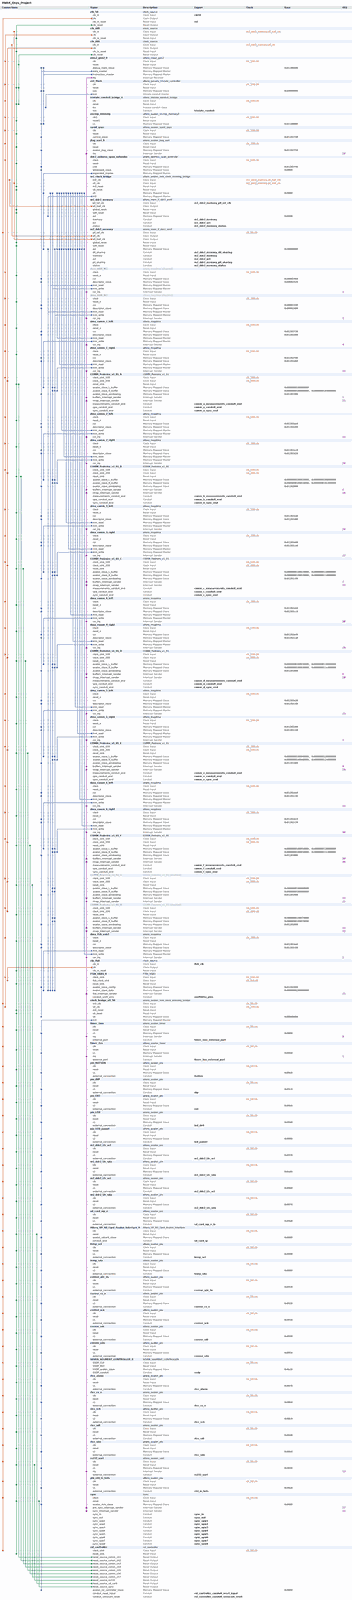
[diagram p0: system contents, whole]
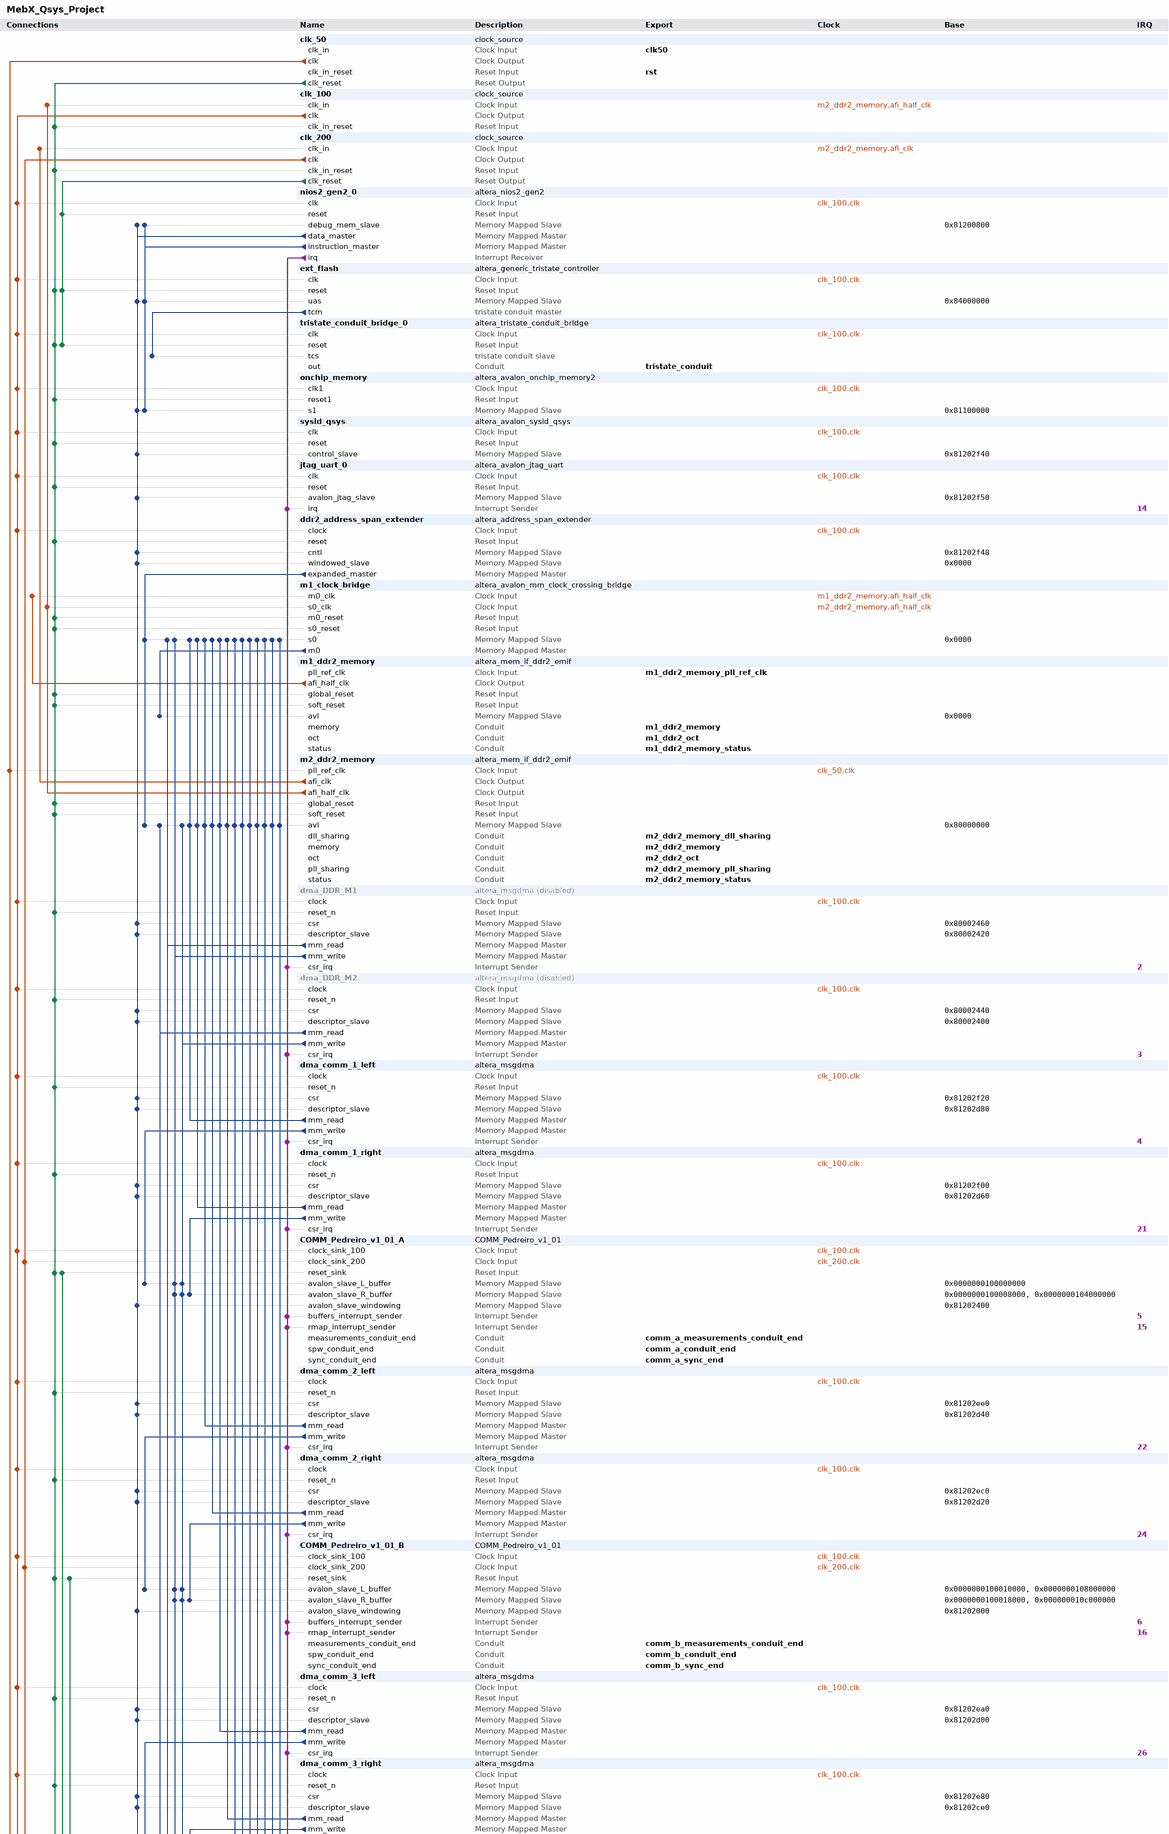
[diagram p1: system contents, upper part]
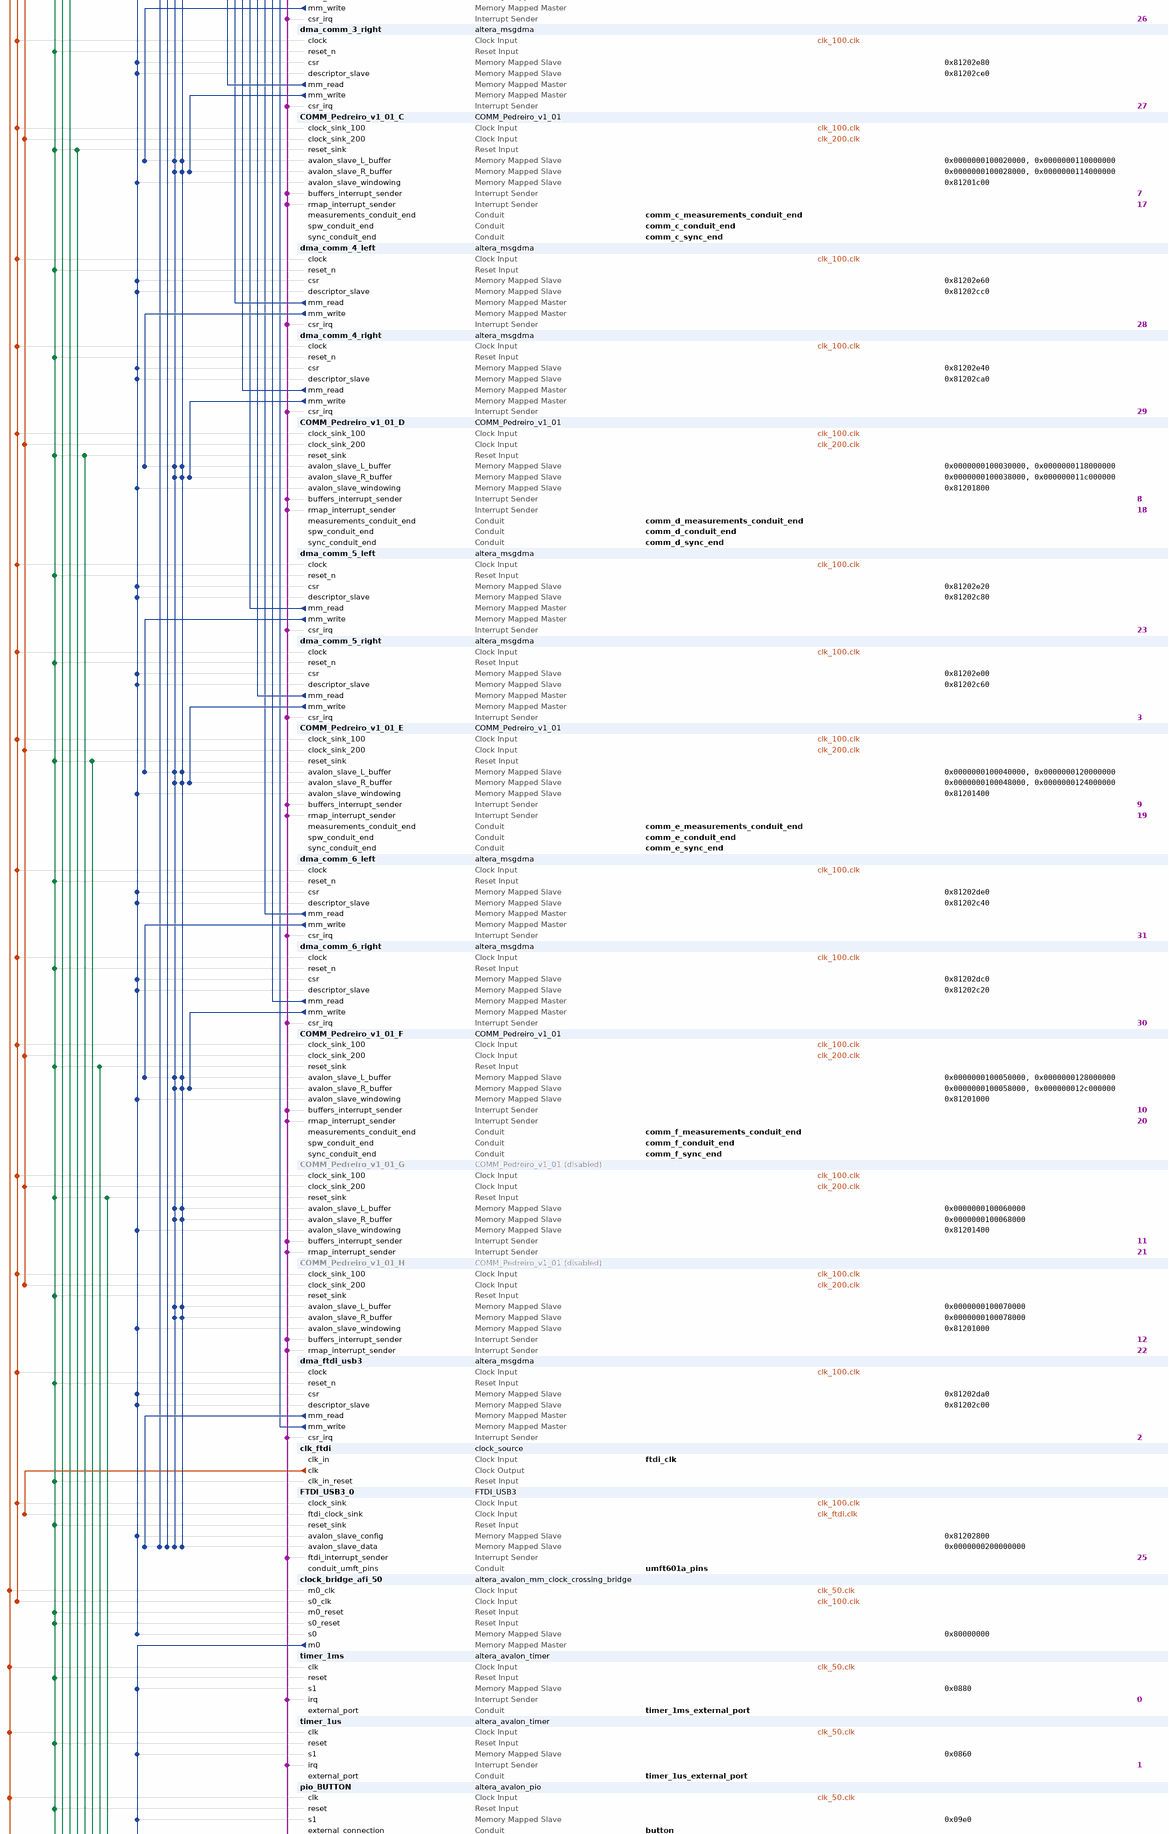
[diagram p2: system contents, middle part]
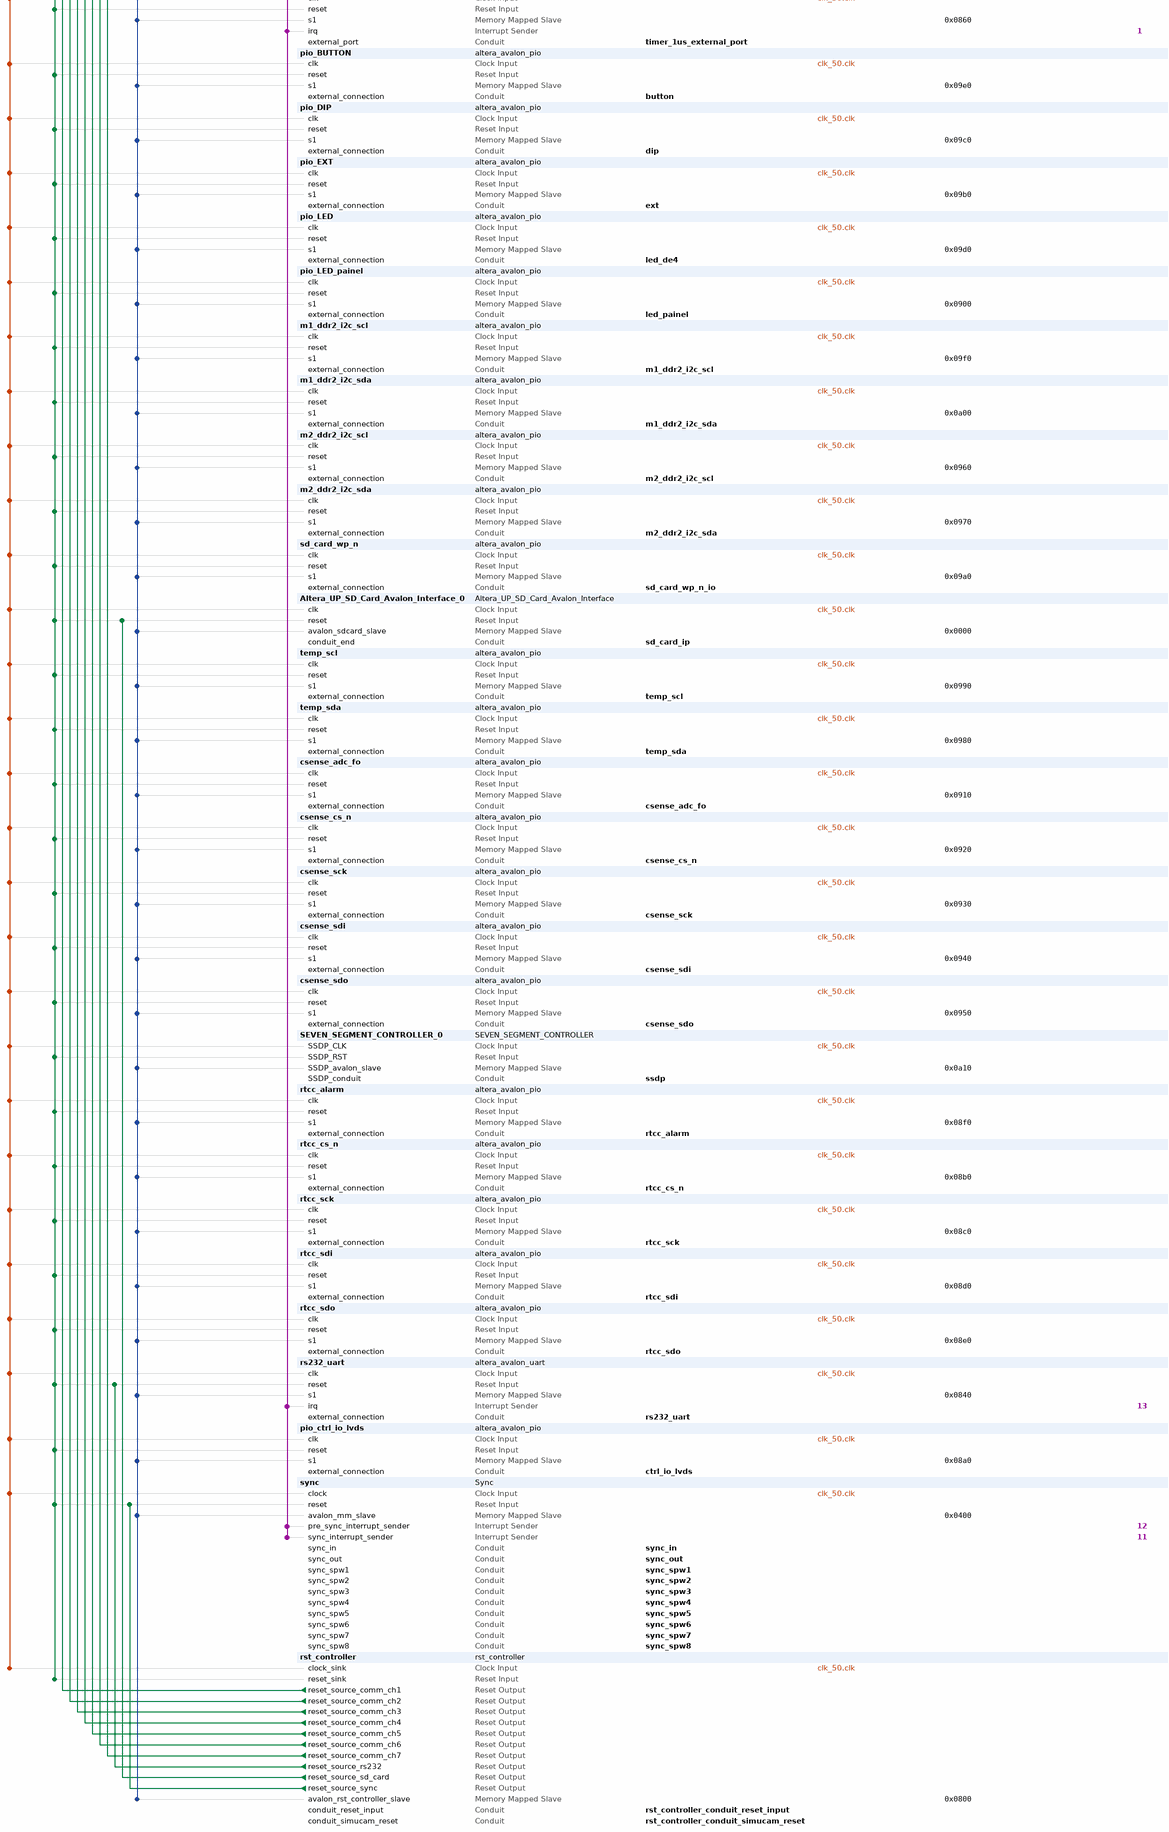
[diagram p3: system contents, lower part]
# Platform Designer (Qsys) system MebX_Qsys_Project, Stratix IV EP4SGX530KH40C2
# Parameters at their usual value, and those the tool derives, are not listed.
package require -exact qsys 18.1
create_system MebX_Qsys_Project
set_project_property DEVICE_FAMILY {Stratix IV}
set_project_property DEVICE EP4SGX530KH40C2

add_instance clk_50 clock_source 18.1
set_instance_parameter_value clk_50 clockFrequency 50000000

add_instance clk_100 clock_source 18.1
set_instance_parameter_value clk_100 clockFrequency 100000000

add_instance clk_200 clock_source 18.1
set_instance_parameter_value clk_200 clockFrequency 200000000

add_instance nios2_gen2_0 altera_nios2_gen2 18.1
set_instance_parameter_value nios2_gen2_0 dcache_size 0
set_instance_parameter_value nios2_gen2_0 debug_hwbreakpoint 2
set_instance_parameter_value nios2_gen2_0 dividerType srt2
set_instance_parameter_value nios2_gen2_0 exceptionSlave onchip_memory.s1
set_instance_parameter_value nios2_gen2_0 icache_burstType Sequential
set_instance_parameter_value nios2_gen2_0 icache_size 4096
set_instance_parameter_value nios2_gen2_0 impl Fast
set_instance_parameter_value nios2_gen2_0 mul_64_impl 1
set_instance_parameter_value nios2_gen2_0 mul_shift_choice 1
set_instance_parameter_value nios2_gen2_0 resetOffset 33685504
set_instance_parameter_value nios2_gen2_0 resetSlave ext_flash.uas
set_instance_parameter_value nios2_gen2_0 setting_support31bitdcachebypass false

add_instance ext_flash altera_generic_tristate_controller 18.1
set_instance_parameter_value ext_flash ACTIVE_LOW_BEGINTRANSFER 0
set_instance_parameter_value ext_flash ACTIVE_LOW_BYTEENABLE 0
set_instance_parameter_value ext_flash ACTIVE_LOW_OUTPUTENABLE 0
set_instance_parameter_value ext_flash ACTIVE_LOW_READ 1
set_instance_parameter_value ext_flash CHIPSELECT_THROUGH_READLATENCY 0
set_instance_parameter_value ext_flash INTERFACE_ASSIGNMENT_KEYS embeddedsw.configuration.isFlash,embeddedsw.configuration.isNonVolatileStorage,embeddedsw.configuration.isMemoryDevice
set_instance_parameter_value ext_flash INTERFACE_ASSIGNMENT_VALUES 1,1,1
set_instance_parameter_value ext_flash MODULE_ASSIGNMENT_KEYS embeddedsw.configuration.hwClassnameDriverSupportList,embeddedsw.configuration.hwClassnameDriverSupportDefault,embeddedsw.CMacro.SETUP_VALUE,embeddedsw.CMacro.WAIT_VALUE,embeddedsw.CMacro.HOLD_VALUE,embeddedsw.CMacro.TIMING_UNITS,embeddedsw.CMacro.SIZE,embeddedsw.memoryInfo.MEM_INIT_DATA_WIDTH,embeddedsw.memoryInfo.HAS_BYTE_LANE,embeddedsw.memoryInfo.IS_FLASH,embeddedsw.memoryInfo.GENERATE_DAT_SYM,embeddedsw.memoryInfo.GENERATE_FLASH,embeddedsw.memoryInfo.DAT_SYM_INSTALL_DIR,embeddedsw.memoryInfo.FLASH_INSTALL_DIR
set_instance_parameter_value ext_flash MODULE_ASSIGNMENT_VALUES "altera_avalon_lan91c111\\,altera_avalon_cfi_flash,altera_avalon_cfi_flash,25,100,20,\"ns\",33554432u,16,1,1,1,1,SIM_DIR,APP_DIR"
set_instance_parameter_value ext_flash TCM_ADDRESS_W 26
set_instance_parameter_value ext_flash TCM_BYTEENABLE_W 2
set_instance_parameter_value ext_flash TCM_DATA_HOLD 20
set_instance_parameter_value ext_flash TCM_DATA_W 16
set_instance_parameter_value ext_flash TCM_MAX_PENDING_READ_TRANSACTIONS 3
set_instance_parameter_value ext_flash TCM_READLATENCY 2
set_instance_parameter_value ext_flash TCM_READ_WAIT 100
set_instance_parameter_value ext_flash TCM_SETUP_WAIT 25
set_instance_parameter_value ext_flash TCM_SYMBOLS_PER_WORD 2
set_instance_parameter_value ext_flash TCM_TIMING_UNITS 0
set_instance_parameter_value ext_flash TCM_TURNAROUND_TIME 2
set_instance_parameter_value ext_flash TCM_WRITE_WAIT 100
set_instance_parameter_value ext_flash USE_BEGINTRANSFER 0
set_instance_parameter_value ext_flash USE_BYTEENABLE 0
set_instance_parameter_value ext_flash USE_OUTPUTENABLE 0
set_instance_parameter_value ext_flash USE_READ 1

add_instance tristate_conduit_bridge_0 altera_tristate_conduit_bridge 18.1

add_instance onchip_memory altera_avalon_onchip_memory2 18.1
set_instance_parameter_value onchip_memory blockType M9K
set_instance_parameter_value onchip_memory dataWidth 32
set_instance_parameter_value onchip_memory dualPort false
set_instance_parameter_value onchip_memory initMemContent false
set_instance_parameter_value onchip_memory initializationFileName onchip_mem.hex
set_instance_parameter_value onchip_memory memorySize 1048576

add_instance sysid_qsys altera_avalon_sysid_qsys 18.1
set_instance_parameter_value sysid_qsys id 113

add_instance jtag_uart_0 altera_avalon_jtag_uart 18.1
set_instance_parameter_value jtag_uart_0 simInteractiveOptions NO_INTERACTIVE_WINDOWS

add_instance ddr2_address_span_extender altera_address_span_extender 18.1
set_instance_parameter_value ddr2_address_span_extender BURSTCOUNT_WIDTH 8
set_instance_parameter_value ddr2_address_span_extender DATA_WIDTH 32
set_instance_parameter_value ddr2_address_span_extender ENABLE_SLAVE_PORT true
set_instance_parameter_value ddr2_address_span_extender MASTER_ADDRESS_DEF 0
set_instance_parameter_value ddr2_address_span_extender MAX_PENDING_READS 8
set_instance_parameter_value ddr2_address_span_extender SLAVE_ADDRESS_WIDTH 29

add_instance m1_clock_bridge altera_avalon_mm_clock_crossing_bridge 18.1
set_instance_parameter_value m1_clock_bridge ADDRESS_WIDTH 31
set_instance_parameter_value m1_clock_bridge COMMAND_FIFO_DEPTH 8
set_instance_parameter_value m1_clock_bridge DATA_WIDTH 256
set_instance_parameter_value m1_clock_bridge MASTER_SYNC_DEPTH 2
set_instance_parameter_value m1_clock_bridge MAX_BURST_SIZE 4
set_instance_parameter_value m1_clock_bridge RESPONSE_FIFO_DEPTH 8
set_instance_parameter_value m1_clock_bridge SLAVE_SYNC_DEPTH 2
set_instance_parameter_value m1_clock_bridge USE_AUTO_ADDRESS_WIDTH 1

add_instance m1_ddr2_memory altera_mem_if_ddr2_emif 18.1
set_instance_parameter_value m1_ddr2_memory AVL_MAX_SIZE 128
set_instance_parameter_value m1_ddr2_memory CALIBRATION_MODE Full
set_instance_parameter_value m1_ddr2_memory DLL_SHARING_MODE None
set_instance_parameter_value m1_ddr2_memory EXPORT_AFI_HALF_CLK true
set_instance_parameter_value m1_ddr2_memory MEM_BANKADDR_WIDTH 3
set_instance_parameter_value m1_ddr2_memory MEM_CLK_FREQ 400.0
set_instance_parameter_value m1_ddr2_memory MEM_COL_ADDR_WIDTH 10
set_instance_parameter_value m1_ddr2_memory MEM_DQ_WIDTH 64
set_instance_parameter_value m1_ddr2_memory MEM_NUMBER_OF_RANKS_PER_DIMM 2
set_instance_parameter_value m1_ddr2_memory MEM_ROW_ADDR_WIDTH 14
set_instance_parameter_value m1_ddr2_memory MEM_TCL 5
set_instance_parameter_value m1_ddr2_memory MEM_TRAS_NS 45.0
set_instance_parameter_value m1_ddr2_memory PLL_SHARING_MODE None
set_instance_parameter_value m1_ddr2_memory POWER_OF_TWO_BUS true
set_instance_parameter_value m1_ddr2_memory REF_CLK_FREQ 50.0
set_instance_parameter_value m1_ddr2_memory TIMING_TDQSQ 240
set_instance_parameter_value m1_ddr2_memory TIMING_TIH 375
set_instance_parameter_value m1_ddr2_memory TIMING_TQHS 340
set_instance_parameter_value m1_ddr2_memory USER_DEBUG_LEVEL 0

add_instance m2_ddr2_memory altera_mem_if_ddr2_emif 18.1
set_instance_parameter_value m2_ddr2_memory AVL_MAX_SIZE 128
set_instance_parameter_value m2_ddr2_memory CALIBRATION_MODE Full
set_instance_parameter_value m2_ddr2_memory DLL_SHARING_MODE Master
set_instance_parameter_value m2_ddr2_memory EXPORT_AFI_HALF_CLK true
set_instance_parameter_value m2_ddr2_memory MEM_BANKADDR_WIDTH 3
set_instance_parameter_value m2_ddr2_memory MEM_CLK_FREQ 400.0
set_instance_parameter_value m2_ddr2_memory MEM_COL_ADDR_WIDTH 10
set_instance_parameter_value m2_ddr2_memory MEM_DQ_WIDTH 64
set_instance_parameter_value m2_ddr2_memory MEM_NUMBER_OF_RANKS_PER_DIMM 2
set_instance_parameter_value m2_ddr2_memory MEM_ROW_ADDR_WIDTH 14
set_instance_parameter_value m2_ddr2_memory MEM_TCL 5
set_instance_parameter_value m2_ddr2_memory MEM_TRAS_NS 45.0
set_instance_parameter_value m2_ddr2_memory PLL_SHARING_MODE Master
set_instance_parameter_value m2_ddr2_memory POWER_OF_TWO_BUS true
set_instance_parameter_value m2_ddr2_memory REF_CLK_FREQ 50.0
set_instance_parameter_value m2_ddr2_memory TIMING_TDQSQ 240
set_instance_parameter_value m2_ddr2_memory TIMING_TIH 375
set_instance_parameter_value m2_ddr2_memory TIMING_TQHS 340
set_instance_parameter_value m2_ddr2_memory USER_DEBUG_LEVEL 0

add_instance dma_DDR_M1 altera_msgdma 18.1
set_instance_property dma_DDR_M1 ENABLED false
set_instance_parameter_value dma_DDR_M1 BURST_ENABLE 0
set_instance_parameter_value dma_DDR_M1 DATA_FIFO_DEPTH 128
set_instance_parameter_value dma_DDR_M1 DATA_WIDTH 256
set_instance_parameter_value dma_DDR_M1 DESCRIPTOR_FIFO_DEPTH 128
set_instance_parameter_value dma_DDR_M1 ENHANCED_FEATURES 1
set_instance_parameter_value dma_DDR_M1 ERROR_ENABLE 0
set_instance_parameter_value dma_DDR_M1 MAX_BURST_COUNT 128
set_instance_parameter_value dma_DDR_M1 MAX_BYTE 67108864
set_instance_parameter_value dma_DDR_M1 MODE 0
set_instance_parameter_value dma_DDR_M1 PACKET_ENABLE 0
set_instance_parameter_value dma_DDR_M1 TRANSFER_TYPE {Full Word Accesses Only}

add_instance dma_DDR_M2 altera_msgdma 18.1
set_instance_property dma_DDR_M2 ENABLED false
set_instance_parameter_value dma_DDR_M2 BURST_ENABLE 0
set_instance_parameter_value dma_DDR_M2 DATA_FIFO_DEPTH 128
set_instance_parameter_value dma_DDR_M2 DATA_WIDTH 256
set_instance_parameter_value dma_DDR_M2 DESCRIPTOR_FIFO_DEPTH 128
set_instance_parameter_value dma_DDR_M2 ENHANCED_FEATURES 1
set_instance_parameter_value dma_DDR_M2 ERROR_ENABLE 0
set_instance_parameter_value dma_DDR_M2 MAX_BURST_COUNT 128
set_instance_parameter_value dma_DDR_M2 MAX_BYTE 67108864
set_instance_parameter_value dma_DDR_M2 MODE 0
set_instance_parameter_value dma_DDR_M2 PACKET_ENABLE 0
set_instance_parameter_value dma_DDR_M2 TRANSFER_TYPE {Full Word Accesses Only}

add_instance dma_comm_1_left altera_msgdma 18.1
set_instance_parameter_value dma_comm_1_left BURST_ENABLE 0
set_instance_parameter_value dma_comm_1_left DATA_FIFO_DEPTH 128
set_instance_parameter_value dma_comm_1_left DATA_WIDTH 256
set_instance_parameter_value dma_comm_1_left DESCRIPTOR_FIFO_DEPTH 128
set_instance_parameter_value dma_comm_1_left ENHANCED_FEATURES 1
set_instance_parameter_value dma_comm_1_left ERROR_ENABLE 0
set_instance_parameter_value dma_comm_1_left MAX_BURST_COUNT 128
set_instance_parameter_value dma_comm_1_left MAX_BYTE 67108864
set_instance_parameter_value dma_comm_1_left MODE 0
set_instance_parameter_value dma_comm_1_left PACKET_ENABLE 0
set_instance_parameter_value dma_comm_1_left TRANSFER_TYPE {Full Word Accesses Only}

add_instance dma_comm_1_right altera_msgdma 18.1
set_instance_parameter_value dma_comm_1_right BURST_ENABLE 0
set_instance_parameter_value dma_comm_1_right DATA_FIFO_DEPTH 128
set_instance_parameter_value dma_comm_1_right DATA_WIDTH 256
set_instance_parameter_value dma_comm_1_right DESCRIPTOR_FIFO_DEPTH 128
set_instance_parameter_value dma_comm_1_right ENHANCED_FEATURES 1
set_instance_parameter_value dma_comm_1_right ERROR_ENABLE 0
set_instance_parameter_value dma_comm_1_right MAX_BURST_COUNT 128
set_instance_parameter_value dma_comm_1_right MAX_BYTE 67108864
set_instance_parameter_value dma_comm_1_right MODE 0
set_instance_parameter_value dma_comm_1_right PACKET_ENABLE 0
set_instance_parameter_value dma_comm_1_right TRANSFER_TYPE {Full Word Accesses Only}

add_instance COMM_Pedreiro_v1_01_A COMM_Pedreiro_v1_01 2.2

add_instance dma_comm_2_left altera_msgdma 18.1
set_instance_parameter_value dma_comm_2_left BURST_ENABLE 0
set_instance_parameter_value dma_comm_2_left DATA_FIFO_DEPTH 128
set_instance_parameter_value dma_comm_2_left DATA_WIDTH 256
set_instance_parameter_value dma_comm_2_left DESCRIPTOR_FIFO_DEPTH 128
set_instance_parameter_value dma_comm_2_left ENHANCED_FEATURES 1
set_instance_parameter_value dma_comm_2_left ERROR_ENABLE 0
set_instance_parameter_value dma_comm_2_left MAX_BURST_COUNT 128
set_instance_parameter_value dma_comm_2_left MAX_BYTE 67108864
set_instance_parameter_value dma_comm_2_left MODE 0
set_instance_parameter_value dma_comm_2_left PACKET_ENABLE 0
set_instance_parameter_value dma_comm_2_left TRANSFER_TYPE {Full Word Accesses Only}

add_instance dma_comm_2_right altera_msgdma 18.1
set_instance_parameter_value dma_comm_2_right BURST_ENABLE 0
set_instance_parameter_value dma_comm_2_right DATA_FIFO_DEPTH 128
set_instance_parameter_value dma_comm_2_right DATA_WIDTH 256
set_instance_parameter_value dma_comm_2_right DESCRIPTOR_FIFO_DEPTH 128
set_instance_parameter_value dma_comm_2_right ENHANCED_FEATURES 1
set_instance_parameter_value dma_comm_2_right ERROR_ENABLE 0
set_instance_parameter_value dma_comm_2_right MAX_BURST_COUNT 128
set_instance_parameter_value dma_comm_2_right MAX_BYTE 67108864
set_instance_parameter_value dma_comm_2_right MODE 0
set_instance_parameter_value dma_comm_2_right PACKET_ENABLE 0
set_instance_parameter_value dma_comm_2_right TRANSFER_TYPE {Full Word Accesses Only}

add_instance COMM_Pedreiro_v1_01_B COMM_Pedreiro_v1_01 2.2

add_instance dma_comm_3_left altera_msgdma 18.1
set_instance_parameter_value dma_comm_3_left BURST_ENABLE 0
set_instance_parameter_value dma_comm_3_left DATA_FIFO_DEPTH 128
set_instance_parameter_value dma_comm_3_left DATA_WIDTH 256
set_instance_parameter_value dma_comm_3_left DESCRIPTOR_FIFO_DEPTH 128
set_instance_parameter_value dma_comm_3_left ENHANCED_FEATURES 1
set_instance_parameter_value dma_comm_3_left ERROR_ENABLE 0
set_instance_parameter_value dma_comm_3_left MAX_BURST_COUNT 128
set_instance_parameter_value dma_comm_3_left MAX_BYTE 67108864
set_instance_parameter_value dma_comm_3_left MODE 0
set_instance_parameter_value dma_comm_3_left PACKET_ENABLE 0
set_instance_parameter_value dma_comm_3_left TRANSFER_TYPE {Full Word Accesses Only}

add_instance dma_comm_3_right altera_msgdma 18.1
set_instance_parameter_value dma_comm_3_right BURST_ENABLE 0
set_instance_parameter_value dma_comm_3_right DATA_FIFO_DEPTH 128
set_instance_parameter_value dma_comm_3_right DATA_WIDTH 256
set_instance_parameter_value dma_comm_3_right DESCRIPTOR_FIFO_DEPTH 128
set_instance_parameter_value dma_comm_3_right ENHANCED_FEATURES 1
set_instance_parameter_value dma_comm_3_right ERROR_ENABLE 0
set_instance_parameter_value dma_comm_3_right MAX_BURST_COUNT 128
set_instance_parameter_value dma_comm_3_right MAX_BYTE 67108864
set_instance_parameter_value dma_comm_3_right MODE 0
set_instance_parameter_value dma_comm_3_right PACKET_ENABLE 0
set_instance_parameter_value dma_comm_3_right TRANSFER_TYPE {Full Word Accesses Only}

add_instance COMM_Pedreiro_v1_01_C COMM_Pedreiro_v1_01 2.2

add_instance dma_comm_4_left altera_msgdma 18.1
set_instance_parameter_value dma_comm_4_left BURST_ENABLE 0
set_instance_parameter_value dma_comm_4_left DATA_FIFO_DEPTH 128
set_instance_parameter_value dma_comm_4_left DATA_WIDTH 256
set_instance_parameter_value dma_comm_4_left DESCRIPTOR_FIFO_DEPTH 128
set_instance_parameter_value dma_comm_4_left ENHANCED_FEATURES 1
set_instance_parameter_value dma_comm_4_left ERROR_ENABLE 0
set_instance_parameter_value dma_comm_4_left MAX_BURST_COUNT 128
set_instance_parameter_value dma_comm_4_left MAX_BYTE 67108864
set_instance_parameter_value dma_comm_4_left MODE 0
set_instance_parameter_value dma_comm_4_left PACKET_ENABLE 0
set_instance_parameter_value dma_comm_4_left TRANSFER_TYPE {Full Word Accesses Only}

add_instance dma_comm_4_right altera_msgdma 18.1
set_instance_parameter_value dma_comm_4_right BURST_ENABLE 0
set_instance_parameter_value dma_comm_4_right DATA_FIFO_DEPTH 128
set_instance_parameter_value dma_comm_4_right DATA_WIDTH 256
set_instance_parameter_value dma_comm_4_right DESCRIPTOR_FIFO_DEPTH 128
set_instance_parameter_value dma_comm_4_right ENHANCED_FEATURES 1
set_instance_parameter_value dma_comm_4_right ERROR_ENABLE 0
set_instance_parameter_value dma_comm_4_right MAX_BURST_COUNT 128
set_instance_parameter_value dma_comm_4_right MAX_BYTE 67108864
set_instance_parameter_value dma_comm_4_right MODE 0
set_instance_parameter_value dma_comm_4_right PACKET_ENABLE 0
set_instance_parameter_value dma_comm_4_right TRANSFER_TYPE {Full Word Accesses Only}

add_instance COMM_Pedreiro_v1_01_D COMM_Pedreiro_v1_01 2.2

add_instance dma_comm_5_left altera_msgdma 18.1
set_instance_parameter_value dma_comm_5_left BURST_ENABLE 0
set_instance_parameter_value dma_comm_5_left DATA_FIFO_DEPTH 128
set_instance_parameter_value dma_comm_5_left DATA_WIDTH 256
set_instance_parameter_value dma_comm_5_left DESCRIPTOR_FIFO_DEPTH 128
set_instance_parameter_value dma_comm_5_left ENHANCED_FEATURES 1
set_instance_parameter_value dma_comm_5_left ERROR_ENABLE 0
set_instance_parameter_value dma_comm_5_left MAX_BURST_COUNT 128
set_instance_parameter_value dma_comm_5_left MAX_BYTE 67108864
set_instance_parameter_value dma_comm_5_left MODE 0
set_instance_parameter_value dma_comm_5_left PACKET_ENABLE 0
set_instance_parameter_value dma_comm_5_left TRANSFER_TYPE {Full Word Accesses Only}

add_instance dma_comm_5_right altera_msgdma 18.1
set_instance_parameter_value dma_comm_5_right BURST_ENABLE 0
set_instance_parameter_value dma_comm_5_right DATA_FIFO_DEPTH 128
set_instance_parameter_value dma_comm_5_right DATA_WIDTH 256
set_instance_parameter_value dma_comm_5_right DESCRIPTOR_FIFO_DEPTH 128
set_instance_parameter_value dma_comm_5_right ENHANCED_FEATURES 1
set_instance_parameter_value dma_comm_5_right ERROR_ENABLE 0
set_instance_parameter_value dma_comm_5_right MAX_BURST_COUNT 128
set_instance_parameter_value dma_comm_5_right MAX_BYTE 67108864
set_instance_parameter_value dma_comm_5_right MODE 0
set_instance_parameter_value dma_comm_5_right PACKET_ENABLE 0
set_instance_parameter_value dma_comm_5_right TRANSFER_TYPE {Full Word Accesses Only}

add_instance COMM_Pedreiro_v1_01_E COMM_Pedreiro_v1_01 2.2

add_instance dma_comm_6_left altera_msgdma 18.1
set_instance_parameter_value dma_comm_6_left BURST_ENABLE 0
set_instance_parameter_value dma_comm_6_left DATA_FIFO_DEPTH 128
set_instance_parameter_value dma_comm_6_left DATA_WIDTH 256
set_instance_parameter_value dma_comm_6_left DESCRIPTOR_FIFO_DEPTH 128
set_instance_parameter_value dma_comm_6_left ENHANCED_FEATURES 1
set_instance_parameter_value dma_comm_6_left ERROR_ENABLE 0
set_instance_parameter_value dma_comm_6_left MAX_BURST_COUNT 128
set_instance_parameter_value dma_comm_6_left MAX_BYTE 67108864
set_instance_parameter_value dma_comm_6_left MODE 0
set_instance_parameter_value dma_comm_6_left PACKET_ENABLE 0
set_instance_parameter_value dma_comm_6_left TRANSFER_TYPE {Full Word Accesses Only}

add_instance dma_comm_6_right altera_msgdma 18.1
set_instance_parameter_value dma_comm_6_right BURST_ENABLE 0
set_instance_parameter_value dma_comm_6_right DATA_FIFO_DEPTH 128
set_instance_parameter_value dma_comm_6_right DATA_WIDTH 256
set_instance_parameter_value dma_comm_6_right DESCRIPTOR_FIFO_DEPTH 128
set_instance_parameter_value dma_comm_6_right ENHANCED_FEATURES 1
set_instance_parameter_value dma_comm_6_right ERROR_ENABLE 0
set_instance_parameter_value dma_comm_6_right MAX_BURST_COUNT 128
set_instance_parameter_value dma_comm_6_right MAX_BYTE 67108864
set_instance_parameter_value dma_comm_6_right MODE 0
set_instance_parameter_value dma_comm_6_right PACKET_ENABLE 0
set_instance_parameter_value dma_comm_6_right TRANSFER_TYPE {Full Word Accesses Only}

add_instance COMM_Pedreiro_v1_01_F COMM_Pedreiro_v1_01 2.2

add_instance COMM_Pedreiro_v1_01_G COMM_Pedreiro_v1_01 2.2
set_instance_property COMM_Pedreiro_v1_01_G ENABLED false

add_instance COMM_Pedreiro_v1_01_H COMM_Pedreiro_v1_01 2.2
set_instance_property COMM_Pedreiro_v1_01_H ENABLED false

add_instance dma_ftdi_usb3 altera_msgdma 18.1
set_instance_parameter_value dma_ftdi_usb3 BURST_ENABLE 0
set_instance_parameter_value dma_ftdi_usb3 DATA_FIFO_DEPTH 128
set_instance_parameter_value dma_ftdi_usb3 DATA_WIDTH 256
set_instance_parameter_value dma_ftdi_usb3 DESCRIPTOR_FIFO_DEPTH 128
set_instance_parameter_value dma_ftdi_usb3 ENHANCED_FEATURES 1
set_instance_parameter_value dma_ftdi_usb3 ERROR_ENABLE 0
set_instance_parameter_value dma_ftdi_usb3 MAX_BURST_COUNT 128
set_instance_parameter_value dma_ftdi_usb3 MAX_BYTE 67108864
set_instance_parameter_value dma_ftdi_usb3 MODE 0
set_instance_parameter_value dma_ftdi_usb3 PACKET_ENABLE 0
set_instance_parameter_value dma_ftdi_usb3 TRANSFER_TYPE {Full Word Accesses Only}

add_instance clk_ftdi clock_source 18.1
set_instance_parameter_value clk_ftdi clockFrequency 100000000

add_instance FTDI_USB3_0 FTDI_USB3 1.7

add_instance clock_bridge_afi_50 altera_avalon_mm_clock_crossing_bridge 18.1
set_instance_parameter_value clock_bridge_afi_50 ADDRESS_WIDTH 32
set_instance_parameter_value clock_bridge_afi_50 COMMAND_FIFO_DEPTH 4
set_instance_parameter_value clock_bridge_afi_50 DATA_WIDTH 32
set_instance_parameter_value clock_bridge_afi_50 MASTER_SYNC_DEPTH 2
set_instance_parameter_value clock_bridge_afi_50 MAX_BURST_SIZE 1
set_instance_parameter_value clock_bridge_afi_50 RESPONSE_FIFO_DEPTH 4
set_instance_parameter_value clock_bridge_afi_50 SLAVE_SYNC_DEPTH 2
set_instance_parameter_value clock_bridge_afi_50 USE_AUTO_ADDRESS_WIDTH 1

add_instance timer_1ms altera_avalon_timer 18.1
set_instance_parameter_value timer_1ms alwaysRun true
set_instance_parameter_value timer_1ms period 1
set_instance_parameter_value timer_1ms periodUnits MSEC
set_instance_parameter_value timer_1ms timeoutPulseOutput true

add_instance timer_1us altera_avalon_timer 18.1
set_instance_parameter_value timer_1us alwaysRun true
set_instance_parameter_value timer_1us period 1
set_instance_parameter_value timer_1us periodUnits USEC
set_instance_parameter_value timer_1us timeoutPulseOutput true

add_instance pio_BUTTON altera_avalon_pio 18.1
set_instance_parameter_value pio_BUTTON direction Input
set_instance_parameter_value pio_BUTTON width 4

add_instance pio_DIP altera_avalon_pio 18.1
set_instance_parameter_value pio_DIP direction Input
set_instance_parameter_value pio_DIP width 8

add_instance pio_EXT altera_avalon_pio 18.1
set_instance_parameter_value pio_EXT bitClearingEdgeCapReg true
set_instance_parameter_value pio_EXT direction Input
set_instance_parameter_value pio_EXT width 1

add_instance pio_LED altera_avalon_pio 18.1
set_instance_parameter_value pio_LED direction Output
set_instance_parameter_value pio_LED width 8

add_instance pio_LED_painel altera_avalon_pio 18.1
set_instance_parameter_value pio_LED_painel direction Output
set_instance_parameter_value pio_LED_painel resetValue 65536
set_instance_parameter_value pio_LED_painel width 21

add_instance m1_ddr2_i2c_scl altera_avalon_pio 18.1
set_instance_parameter_value m1_ddr2_i2c_scl direction Output
set_instance_parameter_value m1_ddr2_i2c_scl width 1

add_instance m1_ddr2_i2c_sda altera_avalon_pio 18.1
set_instance_parameter_value m1_ddr2_i2c_sda direction Bidir
set_instance_parameter_value m1_ddr2_i2c_sda width 1

add_instance m2_ddr2_i2c_scl altera_avalon_pio 18.1
set_instance_parameter_value m2_ddr2_i2c_scl direction Output
set_instance_parameter_value m2_ddr2_i2c_scl width 1

add_instance m2_ddr2_i2c_sda altera_avalon_pio 18.1
set_instance_parameter_value m2_ddr2_i2c_sda direction Bidir
set_instance_parameter_value m2_ddr2_i2c_sda width 1

add_instance sd_card_wp_n altera_avalon_pio 18.1
set_instance_parameter_value sd_card_wp_n direction Input
set_instance_parameter_value sd_card_wp_n width 1

add_instance Altera_UP_SD_Card_Avalon_Interface_0 Altera_UP_SD_Card_Avalon_Interface 18.0

add_instance temp_scl altera_avalon_pio 18.1
set_instance_parameter_value temp_scl direction Output
set_instance_parameter_value temp_scl width 1

add_instance temp_sda altera_avalon_pio 18.1
set_instance_parameter_value temp_sda direction Bidir
set_instance_parameter_value temp_sda width 1

add_instance csense_adc_fo altera_avalon_pio 18.1
set_instance_parameter_value csense_adc_fo direction Output
set_instance_parameter_value csense_adc_fo width 1

add_instance csense_cs_n altera_avalon_pio 18.1
set_instance_parameter_value csense_cs_n direction Output
set_instance_parameter_value csense_cs_n width 2

add_instance csense_sck altera_avalon_pio 18.1
set_instance_parameter_value csense_sck direction Output
set_instance_parameter_value csense_sck width 1

add_instance csense_sdi altera_avalon_pio 18.1
set_instance_parameter_value csense_sdi direction Output
set_instance_parameter_value csense_sdi width 1

add_instance csense_sdo altera_avalon_pio 18.1
set_instance_parameter_value csense_sdo direction Input
set_instance_parameter_value csense_sdo width 1

add_instance SEVEN_SEGMENT_CONTROLLER_0 SEVEN_SEGMENT_CONTROLLER 1.0

add_instance rtcc_alarm altera_avalon_pio 18.1
set_instance_parameter_value rtcc_alarm direction Input
set_instance_parameter_value rtcc_alarm width 1

add_instance rtcc_cs_n altera_avalon_pio 18.1
set_instance_parameter_value rtcc_cs_n direction Output
set_instance_parameter_value rtcc_cs_n width 1

add_instance rtcc_sck altera_avalon_pio 18.1
set_instance_parameter_value rtcc_sck direction Output
set_instance_parameter_value rtcc_sck width 1

add_instance rtcc_sdi altera_avalon_pio 18.1
set_instance_parameter_value rtcc_sdi direction Output
set_instance_parameter_value rtcc_sdi width 1

add_instance rtcc_sdo altera_avalon_pio 18.1
set_instance_parameter_value rtcc_sdo direction Input
set_instance_parameter_value rtcc_sdo width 1

add_instance rs232_uart altera_avalon_uart 18.1
set_instance_parameter_value rs232_uart baud 115200
set_instance_parameter_value rs232_uart dataBits 8
set_instance_parameter_value rs232_uart fixedBaud false
set_instance_parameter_value rs232_uart parity NONE
set_instance_parameter_value rs232_uart stopBits 1

add_instance pio_ctrl_io_lvds altera_avalon_pio 18.1
set_instance_parameter_value pio_ctrl_io_lvds direction Output
set_instance_parameter_value pio_ctrl_io_lvds resetValue 4
set_instance_parameter_value pio_ctrl_io_lvds width 4

add_instance sync Sync 1.6
set_instance_parameter_value sync g_PRE_SYNC_IRQ_NUMBER 12
set_instance_parameter_value sync g_SYNC_IRQ_NUMBER 11

add_instance rst_controller rst_controller 1.5

# connections
add_connection clk_50.clk Altera_UP_SD_Card_Avalon_Interface_0.clk clock
add_connection clk_50.clk clock_bridge_afi_50.m0_clk clock
add_connection clk_50.clk csense_adc_fo.clk clock
add_connection clk_50.clk csense_cs_n.clk clock
add_connection clk_50.clk csense_sck.clk clock
add_connection clk_50.clk csense_sdi.clk clock
add_connection clk_50.clk csense_sdo.clk clock
add_connection clk_50.clk m1_ddr2_i2c_scl.clk clock
add_connection clk_50.clk m1_ddr2_i2c_sda.clk clock
add_connection clk_50.clk m2_ddr2_i2c_scl.clk clock
add_connection clk_50.clk m2_ddr2_i2c_sda.clk clock
add_connection clk_50.clk m2_ddr2_memory.pll_ref_clk clock
add_connection clk_50.clk pio_BUTTON.clk clock
add_connection clk_50.clk pio_ctrl_io_lvds.clk clock
add_connection clk_50.clk pio_DIP.clk clock
add_connection clk_50.clk pio_EXT.clk clock
add_connection clk_50.clk pio_LED.clk clock
add_connection clk_50.clk pio_LED_painel.clk clock
add_connection clk_50.clk rs232_uart.clk clock
add_connection clk_50.clk rst_controller.clock_sink clock
add_connection clk_50.clk rtcc_alarm.clk clock
add_connection clk_50.clk rtcc_cs_n.clk clock
add_connection clk_50.clk rtcc_sck.clk clock
add_connection clk_50.clk rtcc_sdi.clk clock
add_connection clk_50.clk rtcc_sdo.clk clock
add_connection clk_50.clk sd_card_wp_n.clk clock
add_connection clk_50.clk SEVEN_SEGMENT_CONTROLLER_0.SSDP_CLK clock
add_connection clk_50.clk sync.clock clock
add_connection clk_50.clk temp_scl.clk clock
add_connection clk_50.clk temp_sda.clk clock
add_connection clk_50.clk timer_1ms.clk clock
add_connection clk_50.clk timer_1us.clk clock
add_connection clk_100.clk clock_bridge_afi_50.s0_clk clock
add_connection clk_100.clk COMM_Pedreiro_v1_01_A.clock_sink_100 clock
add_connection clk_100.clk COMM_Pedreiro_v1_01_B.clock_sink_100 clock
add_connection clk_100.clk COMM_Pedreiro_v1_01_C.clock_sink_100 clock
add_connection clk_100.clk COMM_Pedreiro_v1_01_D.clock_sink_100 clock
add_connection clk_100.clk COMM_Pedreiro_v1_01_E.clock_sink_100 clock
add_connection clk_100.clk COMM_Pedreiro_v1_01_F.clock_sink_100 clock
add_connection clk_100.clk COMM_Pedreiro_v1_01_G.clock_sink_100 clock
add_connection clk_100.clk COMM_Pedreiro_v1_01_H.clock_sink_100 clock
add_connection clk_100.clk ddr2_address_span_extender.clock clock
add_connection clk_100.clk dma_comm_1_left.clock clock
add_connection clk_100.clk dma_comm_1_right.clock clock
add_connection clk_100.clk dma_comm_2_left.clock clock
add_connection clk_100.clk dma_comm_2_right.clock clock
add_connection clk_100.clk dma_comm_3_left.clock clock
add_connection clk_100.clk dma_comm_3_right.clock clock
add_connection clk_100.clk dma_comm_4_left.clock clock
add_connection clk_100.clk dma_comm_4_right.clock clock
add_connection clk_100.clk dma_comm_5_left.clock clock
add_connection clk_100.clk dma_comm_5_right.clock clock
add_connection clk_100.clk dma_comm_6_left.clock clock
add_connection clk_100.clk dma_comm_6_right.clock clock
add_connection clk_100.clk dma_DDR_M1.clock clock
add_connection clk_100.clk dma_DDR_M2.clock clock
add_connection clk_100.clk dma_ftdi_usb3.clock clock
add_connection clk_100.clk ext_flash.clk clock
add_connection clk_100.clk FTDI_USB3_0.clock_sink clock
add_connection clk_100.clk jtag_uart_0.clk clock
add_connection clk_100.clk nios2_gen2_0.clk clock
add_connection clk_100.clk onchip_memory.clk1 clock
add_connection clk_100.clk sysid_qsys.clk clock
add_connection clk_100.clk tristate_conduit_bridge_0.clk clock
add_connection clk_200.clk COMM_Pedreiro_v1_01_A.clock_sink_200 clock
add_connection clk_200.clk COMM_Pedreiro_v1_01_B.clock_sink_200 clock
add_connection clk_200.clk COMM_Pedreiro_v1_01_C.clock_sink_200 clock
add_connection clk_200.clk COMM_Pedreiro_v1_01_D.clock_sink_200 clock
add_connection clk_200.clk COMM_Pedreiro_v1_01_E.clock_sink_200 clock
add_connection clk_200.clk COMM_Pedreiro_v1_01_F.clock_sink_200 clock
add_connection clk_200.clk COMM_Pedreiro_v1_01_G.clock_sink_200 clock
add_connection clk_200.clk COMM_Pedreiro_v1_01_H.clock_sink_200 clock
add_connection clk_ftdi.clk FTDI_USB3_0.ftdi_clock_sink clock
add_connection m1_ddr2_memory.afi_half_clk m1_clock_bridge.m0_clk clock
add_connection m2_ddr2_memory.afi_clk clk_200.clk_in clock
add_connection m2_ddr2_memory.afi_half_clk clk_100.clk_in clock
add_connection m2_ddr2_memory.afi_half_clk m1_clock_bridge.s0_clk clock
add_connection clk_50.clk_reset Altera_UP_SD_Card_Avalon_Interface_0.reset reset
add_connection clk_50.clk_reset clk_100.clk_in_reset reset
add_connection clk_50.clk_reset clk_200.clk_in_reset reset
add_connection clk_50.clk_reset clk_ftdi.clk_in_reset reset
add_connection clk_50.clk_reset clock_bridge_afi_50.m0_reset reset
add_connection clk_50.clk_reset clock_bridge_afi_50.s0_reset reset
add_connection clk_50.clk_reset COMM_Pedreiro_v1_01_A.reset_sink reset
add_connection clk_50.clk_reset COMM_Pedreiro_v1_01_B.reset_sink reset
add_connection clk_50.clk_reset COMM_Pedreiro_v1_01_C.reset_sink reset
add_connection clk_50.clk_reset COMM_Pedreiro_v1_01_D.reset_sink reset
add_connection clk_50.clk_reset COMM_Pedreiro_v1_01_E.reset_sink reset
add_connection clk_50.clk_reset COMM_Pedreiro_v1_01_F.reset_sink reset
add_connection clk_50.clk_reset COMM_Pedreiro_v1_01_G.reset_sink reset
add_connection clk_50.clk_reset COMM_Pedreiro_v1_01_H.reset_sink reset
add_connection clk_50.clk_reset csense_adc_fo.reset reset
add_connection clk_50.clk_reset csense_cs_n.reset reset
add_connection clk_50.clk_reset csense_sck.reset reset
add_connection clk_50.clk_reset csense_sdi.reset reset
add_connection clk_50.clk_reset csense_sdo.reset reset
add_connection clk_50.clk_reset ddr2_address_span_extender.reset reset
add_connection clk_50.clk_reset dma_comm_1_left.reset_n reset
add_connection clk_50.clk_reset dma_comm_1_right.reset_n reset
add_connection clk_50.clk_reset dma_comm_2_left.reset_n reset
add_connection clk_50.clk_reset dma_comm_2_right.reset_n reset
add_connection clk_50.clk_reset dma_comm_3_left.reset_n reset
add_connection clk_50.clk_reset dma_comm_3_right.reset_n reset
add_connection clk_50.clk_reset dma_comm_4_left.reset_n reset
add_connection clk_50.clk_reset dma_comm_4_right.reset_n reset
add_connection clk_50.clk_reset dma_comm_5_left.reset_n reset
add_connection clk_50.clk_reset dma_comm_5_right.reset_n reset
add_connection clk_50.clk_reset dma_comm_6_left.reset_n reset
add_connection clk_50.clk_reset dma_comm_6_right.reset_n reset
add_connection clk_50.clk_reset dma_DDR_M1.reset_n reset
add_connection clk_50.clk_reset dma_DDR_M2.reset_n reset
add_connection clk_50.clk_reset dma_ftdi_usb3.reset_n reset
add_connection clk_50.clk_reset ext_flash.reset reset
add_connection clk_50.clk_reset FTDI_USB3_0.reset_sink reset
add_connection clk_50.clk_reset jtag_uart_0.reset reset
add_connection clk_50.clk_reset m1_clock_bridge.m0_reset reset
add_connection clk_50.clk_reset m1_clock_bridge.s0_reset reset
add_connection clk_50.clk_reset m1_ddr2_i2c_scl.reset reset
add_connection clk_50.clk_reset m1_ddr2_i2c_sda.reset reset
add_connection clk_50.clk_reset m1_ddr2_memory.global_reset reset
add_connection clk_50.clk_reset m1_ddr2_memory.soft_reset reset
add_connection clk_50.clk_reset m2_ddr2_i2c_scl.reset reset
add_connection clk_50.clk_reset m2_ddr2_i2c_sda.reset reset
add_connection clk_50.clk_reset m2_ddr2_memory.global_reset reset
add_connection clk_50.clk_reset m2_ddr2_memory.soft_reset reset
add_connection clk_50.clk_reset onchip_memory.reset1 reset
add_connection clk_50.clk_reset pio_BUTTON.reset reset
add_connection clk_50.clk_reset pio_ctrl_io_lvds.reset reset
add_connection clk_50.clk_reset pio_DIP.reset reset
add_connection clk_50.clk_reset pio_EXT.reset reset
add_connection clk_50.clk_reset pio_LED.reset reset
add_connection clk_50.clk_reset pio_LED_painel.reset reset
add_connection clk_50.clk_reset rs232_uart.reset reset
add_connection clk_50.clk_reset rst_controller.reset_sink reset
add_connection clk_50.clk_reset rtcc_alarm.reset reset
add_connection clk_50.clk_reset rtcc_cs_n.reset reset
add_connection clk_50.clk_reset rtcc_sck.reset reset
add_connection clk_50.clk_reset rtcc_sdi.reset reset
add_connection clk_50.clk_reset rtcc_sdo.reset reset
add_connection clk_50.clk_reset sd_card_wp_n.reset reset
add_connection clk_50.clk_reset SEVEN_SEGMENT_CONTROLLER_0.SSDP_RST reset
add_connection clk_50.clk_reset sync.reset reset
add_connection clk_50.clk_reset sysid_qsys.reset reset
add_connection clk_50.clk_reset temp_scl.reset reset
add_connection clk_50.clk_reset temp_sda.reset reset
add_connection clk_50.clk_reset timer_1ms.reset reset
add_connection clk_50.clk_reset timer_1us.reset reset
add_connection clk_50.clk_reset tristate_conduit_bridge_0.reset reset
add_connection clk_200.clk_reset ext_flash.reset reset
add_connection clk_200.clk_reset nios2_gen2_0.reset reset
add_connection clk_200.clk_reset tristate_conduit_bridge_0.reset reset
add_connection rst_controller.reset_source_comm_ch1 COMM_Pedreiro_v1_01_A.reset_sink reset
add_connection rst_controller.reset_source_comm_ch2 COMM_Pedreiro_v1_01_B.reset_sink reset
add_connection rst_controller.reset_source_comm_ch3 COMM_Pedreiro_v1_01_C.reset_sink reset
add_connection rst_controller.reset_source_comm_ch4 COMM_Pedreiro_v1_01_D.reset_sink reset
add_connection rst_controller.reset_source_comm_ch5 COMM_Pedreiro_v1_01_E.reset_sink reset
add_connection rst_controller.reset_source_comm_ch6 COMM_Pedreiro_v1_01_F.reset_sink reset
add_connection rst_controller.reset_source_comm_ch7 COMM_Pedreiro_v1_01_G.reset_sink reset
add_connection rst_controller.reset_source_rs232 rs232_uart.reset reset
add_connection rst_controller.reset_source_sd_card Altera_UP_SD_Card_Avalon_Interface_0.reset reset
add_connection rst_controller.reset_source_sync sync.reset reset
add_connection clock_bridge_afi_50.m0 Altera_UP_SD_Card_Avalon_Interface_0.avalon_sdcard_slave avalon
set_connection_parameter_value clock_bridge_afi_50.m0/Altera_UP_SD_Card_Avalon_Interface_0.avalon_sdcard_slave baseAddress 0x0000
add_connection clock_bridge_afi_50.m0 csense_adc_fo.s1 avalon
set_connection_parameter_value clock_bridge_afi_50.m0/csense_adc_fo.s1 baseAddress 0x0910
add_connection clock_bridge_afi_50.m0 csense_cs_n.s1 avalon
set_connection_parameter_value clock_bridge_afi_50.m0/csense_cs_n.s1 baseAddress 0x0920
add_connection clock_bridge_afi_50.m0 csense_sck.s1 avalon
set_connection_parameter_value clock_bridge_afi_50.m0/csense_sck.s1 baseAddress 0x0930
add_connection clock_bridge_afi_50.m0 csense_sdi.s1 avalon
set_connection_parameter_value clock_bridge_afi_50.m0/csense_sdi.s1 baseAddress 0x0940
add_connection clock_bridge_afi_50.m0 csense_sdo.s1 avalon
set_connection_parameter_value clock_bridge_afi_50.m0/csense_sdo.s1 baseAddress 0x0950
add_connection clock_bridge_afi_50.m0 m1_ddr2_i2c_scl.s1 avalon
set_connection_parameter_value clock_bridge_afi_50.m0/m1_ddr2_i2c_scl.s1 baseAddress 0x09f0
add_connection clock_bridge_afi_50.m0 m1_ddr2_i2c_sda.s1 avalon
set_connection_parameter_value clock_bridge_afi_50.m0/m1_ddr2_i2c_sda.s1 baseAddress 0x0a00
add_connection clock_bridge_afi_50.m0 m2_ddr2_i2c_scl.s1 avalon
set_connection_parameter_value clock_bridge_afi_50.m0/m2_ddr2_i2c_scl.s1 baseAddress 0x0960
add_connection clock_bridge_afi_50.m0 m2_ddr2_i2c_sda.s1 avalon
set_connection_parameter_value clock_bridge_afi_50.m0/m2_ddr2_i2c_sda.s1 baseAddress 0x0970
add_connection clock_bridge_afi_50.m0 pio_BUTTON.s1 avalon
set_connection_parameter_value clock_bridge_afi_50.m0/pio_BUTTON.s1 baseAddress 0x09e0
add_connection clock_bridge_afi_50.m0 pio_ctrl_io_lvds.s1 avalon
set_connection_parameter_value clock_bridge_afi_50.m0/pio_ctrl_io_lvds.s1 baseAddress 0x08a0
add_connection clock_bridge_afi_50.m0 pio_DIP.s1 avalon
set_connection_parameter_value clock_bridge_afi_50.m0/pio_DIP.s1 baseAddress 0x09c0
add_connection clock_bridge_afi_50.m0 pio_EXT.s1 avalon
set_connection_parameter_value clock_bridge_afi_50.m0/pio_EXT.s1 baseAddress 0x09b0
add_connection clock_bridge_afi_50.m0 pio_LED.s1 avalon
set_connection_parameter_value clock_bridge_afi_50.m0/pio_LED.s1 baseAddress 0x09d0
add_connection clock_bridge_afi_50.m0 pio_LED_painel.s1 avalon
set_connection_parameter_value clock_bridge_afi_50.m0/pio_LED_painel.s1 baseAddress 0x0900
add_connection clock_bridge_afi_50.m0 rs232_uart.s1 avalon
set_connection_parameter_value clock_bridge_afi_50.m0/rs232_uart.s1 baseAddress 0x0840
add_connection clock_bridge_afi_50.m0 rst_controller.avalon_rst_controller_slave avalon
set_connection_parameter_value clock_bridge_afi_50.m0/rst_controller.avalon_rst_controller_slave baseAddress 0x0800
add_connection clock_bridge_afi_50.m0 rtcc_alarm.s1 avalon
set_connection_parameter_value clock_bridge_afi_50.m0/rtcc_alarm.s1 baseAddress 0x08f0
add_connection clock_bridge_afi_50.m0 rtcc_cs_n.s1 avalon
set_connection_parameter_value clock_bridge_afi_50.m0/rtcc_cs_n.s1 baseAddress 0x08b0
add_connection clock_bridge_afi_50.m0 rtcc_sck.s1 avalon
set_connection_parameter_value clock_bridge_afi_50.m0/rtcc_sck.s1 baseAddress 0x08c0
add_connection clock_bridge_afi_50.m0 rtcc_sdi.s1 avalon
set_connection_parameter_value clock_bridge_afi_50.m0/rtcc_sdi.s1 baseAddress 0x08d0
add_connection clock_bridge_afi_50.m0 rtcc_sdo.s1 avalon
set_connection_parameter_value clock_bridge_afi_50.m0/rtcc_sdo.s1 baseAddress 0x08e0
add_connection clock_bridge_afi_50.m0 sd_card_wp_n.s1 avalon
set_connection_parameter_value clock_bridge_afi_50.m0/sd_card_wp_n.s1 baseAddress 0x09a0
add_connection clock_bridge_afi_50.m0 SEVEN_SEGMENT_CONTROLLER_0.SSDP_avalon_slave avalon
set_connection_parameter_value clock_bridge_afi_50.m0/SEVEN_SEGMENT_CONTROLLER_0.SSDP_avalon_slave baseAddress 0x0a10
add_connection clock_bridge_afi_50.m0 sync.avalon_mm_slave avalon
set_connection_parameter_value clock_bridge_afi_50.m0/sync.avalon_mm_slave baseAddress 0x0400
add_connection clock_bridge_afi_50.m0 temp_scl.s1 avalon
set_connection_parameter_value clock_bridge_afi_50.m0/temp_scl.s1 baseAddress 0x0990
add_connection clock_bridge_afi_50.m0 temp_sda.s1 avalon
set_connection_parameter_value clock_bridge_afi_50.m0/temp_sda.s1 baseAddress 0x0980
add_connection clock_bridge_afi_50.m0 timer_1ms.s1 avalon
set_connection_parameter_value clock_bridge_afi_50.m0/timer_1ms.s1 baseAddress 0x0880
add_connection clock_bridge_afi_50.m0 timer_1us.s1 avalon
set_connection_parameter_value clock_bridge_afi_50.m0/timer_1us.s1 baseAddress 0x0860
add_connection ddr2_address_span_extender.expanded_master m1_clock_bridge.s0 avalon
set_connection_parameter_value ddr2_address_span_extender.expanded_master/m1_clock_bridge.s0 baseAddress 0x0000
add_connection ddr2_address_span_extender.expanded_master m2_ddr2_memory.avl avalon
set_connection_parameter_value ddr2_address_span_extender.expanded_master/m2_ddr2_memory.avl baseAddress 0x80000000
add_connection dma_comm_1_left.mm_read m1_clock_bridge.s0 avalon
set_connection_parameter_value dma_comm_1_left.mm_read/m1_clock_bridge.s0 baseAddress 0x0000
add_connection dma_comm_1_left.mm_read m2_ddr2_memory.avl avalon
set_connection_parameter_value dma_comm_1_left.mm_read/m2_ddr2_memory.avl baseAddress 0x80000000
add_connection dma_comm_1_left.mm_write COMM_Pedreiro_v1_01_A.avalon_slave_L_buffer avalon
set_connection_parameter_value dma_comm_1_left.mm_write/COMM_Pedreiro_v1_01_A.avalon_slave_L_buffer baseAddress 0x0000000100000000
add_connection dma_comm_1_right.mm_read m1_clock_bridge.s0 avalon
set_connection_parameter_value dma_comm_1_right.mm_read/m1_clock_bridge.s0 baseAddress 0x0000
add_connection dma_comm_1_right.mm_read m2_ddr2_memory.avl avalon
set_connection_parameter_value dma_comm_1_right.mm_read/m2_ddr2_memory.avl baseAddress 0x80000000
add_connection dma_comm_1_right.mm_write COMM_Pedreiro_v1_01_A.avalon_slave_R_buffer avalon
set_connection_parameter_value dma_comm_1_right.mm_write/COMM_Pedreiro_v1_01_A.avalon_slave_R_buffer baseAddress 0x0000000104000000
add_connection dma_comm_2_left.mm_read m1_clock_bridge.s0 avalon
set_connection_parameter_value dma_comm_2_left.mm_read/m1_clock_bridge.s0 baseAddress 0x0000
add_connection dma_comm_2_left.mm_read m2_ddr2_memory.avl avalon
set_connection_parameter_value dma_comm_2_left.mm_read/m2_ddr2_memory.avl baseAddress 0x80000000
add_connection dma_comm_2_left.mm_write COMM_Pedreiro_v1_01_B.avalon_slave_L_buffer avalon
set_connection_parameter_value dma_comm_2_left.mm_write/COMM_Pedreiro_v1_01_B.avalon_slave_L_buffer baseAddress 0x0000000108000000
add_connection dma_comm_2_right.mm_read m1_clock_bridge.s0 avalon
set_connection_parameter_value dma_comm_2_right.mm_read/m1_clock_bridge.s0 baseAddress 0x0000
add_connection dma_comm_2_right.mm_read m2_ddr2_memory.avl avalon
set_connection_parameter_value dma_comm_2_right.mm_read/m2_ddr2_memory.avl baseAddress 0x80000000
add_connection dma_comm_2_right.mm_write COMM_Pedreiro_v1_01_B.avalon_slave_R_buffer avalon
set_connection_parameter_value dma_comm_2_right.mm_write/COMM_Pedreiro_v1_01_B.avalon_slave_R_buffer baseAddress 0x000000010c000000
add_connection dma_comm_3_left.mm_read m1_clock_bridge.s0 avalon
set_connection_parameter_value dma_comm_3_left.mm_read/m1_clock_bridge.s0 baseAddress 0x0000
add_connection dma_comm_3_left.mm_read m2_ddr2_memory.avl avalon
set_connection_parameter_value dma_comm_3_left.mm_read/m2_ddr2_memory.avl baseAddress 0x80000000
add_connection dma_comm_3_left.mm_write COMM_Pedreiro_v1_01_C.avalon_slave_L_buffer avalon
set_connection_parameter_value dma_comm_3_left.mm_write/COMM_Pedreiro_v1_01_C.avalon_slave_L_buffer baseAddress 0x0000000110000000
add_connection dma_comm_3_right.mm_read m1_clock_bridge.s0 avalon
set_connection_parameter_value dma_comm_3_right.mm_read/m1_clock_bridge.s0 baseAddress 0x0000
add_connection dma_comm_3_right.mm_read m2_ddr2_memory.avl avalon
set_connection_parameter_value dma_comm_3_right.mm_read/m2_ddr2_memory.avl baseAddress 0x80000000
add_connection dma_comm_3_right.mm_write COMM_Pedreiro_v1_01_C.avalon_slave_R_buffer avalon
set_connection_parameter_value dma_comm_3_right.mm_write/COMM_Pedreiro_v1_01_C.avalon_slave_R_buffer baseAddress 0x0000000114000000
add_connection dma_comm_4_left.mm_read m1_clock_bridge.s0 avalon
set_connection_parameter_value dma_comm_4_left.mm_read/m1_clock_bridge.s0 baseAddress 0x0000
add_connection dma_comm_4_left.mm_read m2_ddr2_memory.avl avalon
set_connection_parameter_value dma_comm_4_left.mm_read/m2_ddr2_memory.avl baseAddress 0x80000000
add_connection dma_comm_4_left.mm_write COMM_Pedreiro_v1_01_D.avalon_slave_L_buffer avalon
set_connection_parameter_value dma_comm_4_left.mm_write/COMM_Pedreiro_v1_01_D.avalon_slave_L_buffer baseAddress 0x0000000118000000
add_connection dma_comm_4_right.mm_read m1_clock_bridge.s0 avalon
set_connection_parameter_value dma_comm_4_right.mm_read/m1_clock_bridge.s0 baseAddress 0x0000
add_connection dma_comm_4_right.mm_read m2_ddr2_memory.avl avalon
set_connection_parameter_value dma_comm_4_right.mm_read/m2_ddr2_memory.avl baseAddress 0x80000000
add_connection dma_comm_4_right.mm_write COMM_Pedreiro_v1_01_D.avalon_slave_R_buffer avalon
set_connection_parameter_value dma_comm_4_right.mm_write/COMM_Pedreiro_v1_01_D.avalon_slave_R_buffer baseAddress 0x000000011c000000
add_connection dma_comm_5_left.mm_read m1_clock_bridge.s0 avalon
set_connection_parameter_value dma_comm_5_left.mm_read/m1_clock_bridge.s0 baseAddress 0x0000
add_connection dma_comm_5_left.mm_read m2_ddr2_memory.avl avalon
set_connection_parameter_value dma_comm_5_left.mm_read/m2_ddr2_memory.avl baseAddress 0x80000000
add_connection dma_comm_5_left.mm_write COMM_Pedreiro_v1_01_E.avalon_slave_L_buffer avalon
set_connection_parameter_value dma_comm_5_left.mm_write/COMM_Pedreiro_v1_01_E.avalon_slave_L_buffer baseAddress 0x0000000120000000
add_connection dma_comm_5_right.mm_read m1_clock_bridge.s0 avalon
set_connection_parameter_value dma_comm_5_right.mm_read/m1_clock_bridge.s0 baseAddress 0x0000
add_connection dma_comm_5_right.mm_read m2_ddr2_memory.avl avalon
set_connection_parameter_value dma_comm_5_right.mm_read/m2_ddr2_memory.avl baseAddress 0x80000000
add_connection dma_comm_5_right.mm_write COMM_Pedreiro_v1_01_E.avalon_slave_R_buffer avalon
set_connection_parameter_value dma_comm_5_right.mm_write/COMM_Pedreiro_v1_01_E.avalon_slave_R_buffer baseAddress 0x0000000124000000
add_connection dma_comm_6_left.mm_read m1_clock_bridge.s0 avalon
set_connection_parameter_value dma_comm_6_left.mm_read/m1_clock_bridge.s0 baseAddress 0x0000
add_connection dma_comm_6_left.mm_read m2_ddr2_memory.avl avalon
set_connection_parameter_value dma_comm_6_left.mm_read/m2_ddr2_memory.avl baseAddress 0x80000000
add_connection dma_comm_6_left.mm_write COMM_Pedreiro_v1_01_F.avalon_slave_L_buffer avalon
set_connection_parameter_value dma_comm_6_left.mm_write/COMM_Pedreiro_v1_01_F.avalon_slave_L_buffer baseAddress 0x0000000128000000
add_connection dma_comm_6_right.mm_read m1_clock_bridge.s0 avalon
set_connection_parameter_value dma_comm_6_right.mm_read/m1_clock_bridge.s0 baseAddress 0x0000
add_connection dma_comm_6_right.mm_read m2_ddr2_memory.avl avalon
set_connection_parameter_value dma_comm_6_right.mm_read/m2_ddr2_memory.avl baseAddress 0x80000000
add_connection dma_comm_6_right.mm_write COMM_Pedreiro_v1_01_F.avalon_slave_R_buffer avalon
set_connection_parameter_value dma_comm_6_right.mm_write/COMM_Pedreiro_v1_01_F.avalon_slave_R_buffer baseAddress 0x000000012c000000
add_connection dma_DDR_M1.mm_read FTDI_USB3_0.avalon_slave_data avalon
set_connection_parameter_value dma_DDR_M1.mm_read/FTDI_USB3_0.avalon_slave_data baseAddress 0x0000000200000000
add_connection dma_DDR_M1.mm_read m1_clock_bridge.s0 avalon
set_connection_parameter_value dma_DDR_M1.mm_read/m1_clock_bridge.s0 baseAddress 0x0000
add_connection dma_DDR_M1.mm_write COMM_Pedreiro_v1_01_A.avalon_slave_L_buffer avalon
set_connection_parameter_value dma_DDR_M1.mm_write/COMM_Pedreiro_v1_01_A.avalon_slave_L_buffer baseAddress 0x0000000100000000
add_connection dma_DDR_M1.mm_write COMM_Pedreiro_v1_01_A.avalon_slave_R_buffer avalon
set_connection_parameter_value dma_DDR_M1.mm_write/COMM_Pedreiro_v1_01_A.avalon_slave_R_buffer baseAddress 0x0000000100008000
add_connection dma_DDR_M1.mm_write COMM_Pedreiro_v1_01_B.avalon_slave_L_buffer avalon
set_connection_parameter_value dma_DDR_M1.mm_write/COMM_Pedreiro_v1_01_B.avalon_slave_L_buffer baseAddress 0x0000000100010000
add_connection dma_DDR_M1.mm_write COMM_Pedreiro_v1_01_B.avalon_slave_R_buffer avalon
set_connection_parameter_value dma_DDR_M1.mm_write/COMM_Pedreiro_v1_01_B.avalon_slave_R_buffer baseAddress 0x0000000100018000
add_connection dma_DDR_M1.mm_write COMM_Pedreiro_v1_01_C.avalon_slave_L_buffer avalon
set_connection_parameter_value dma_DDR_M1.mm_write/COMM_Pedreiro_v1_01_C.avalon_slave_L_buffer baseAddress 0x0000000100020000
add_connection dma_DDR_M1.mm_write COMM_Pedreiro_v1_01_C.avalon_slave_R_buffer avalon
set_connection_parameter_value dma_DDR_M1.mm_write/COMM_Pedreiro_v1_01_C.avalon_slave_R_buffer baseAddress 0x0000000100028000
add_connection dma_DDR_M1.mm_write COMM_Pedreiro_v1_01_D.avalon_slave_L_buffer avalon
set_connection_parameter_value dma_DDR_M1.mm_write/COMM_Pedreiro_v1_01_D.avalon_slave_L_buffer baseAddress 0x0000000100030000
add_connection dma_DDR_M1.mm_write COMM_Pedreiro_v1_01_D.avalon_slave_R_buffer avalon
set_connection_parameter_value dma_DDR_M1.mm_write/COMM_Pedreiro_v1_01_D.avalon_slave_R_buffer baseAddress 0x0000000100038000
add_connection dma_DDR_M1.mm_write COMM_Pedreiro_v1_01_E.avalon_slave_L_buffer avalon
set_connection_parameter_value dma_DDR_M1.mm_write/COMM_Pedreiro_v1_01_E.avalon_slave_L_buffer baseAddress 0x0000000100040000
add_connection dma_DDR_M1.mm_write COMM_Pedreiro_v1_01_E.avalon_slave_R_buffer avalon
